# EasyEDA Pro project OctoSlime_Switch_Unit.eprj

# Schematic Schematic1
Create Date: 2022-07-29; Page Name: P1; Project Name: OctoSlime_Switch_Unit; Schematic Name: Schematic1; Update Date: 2022-08-04; Company: EmbeddedAT; Drawed: KeonMan; Reviewed: KeonMan; Version: 1.0
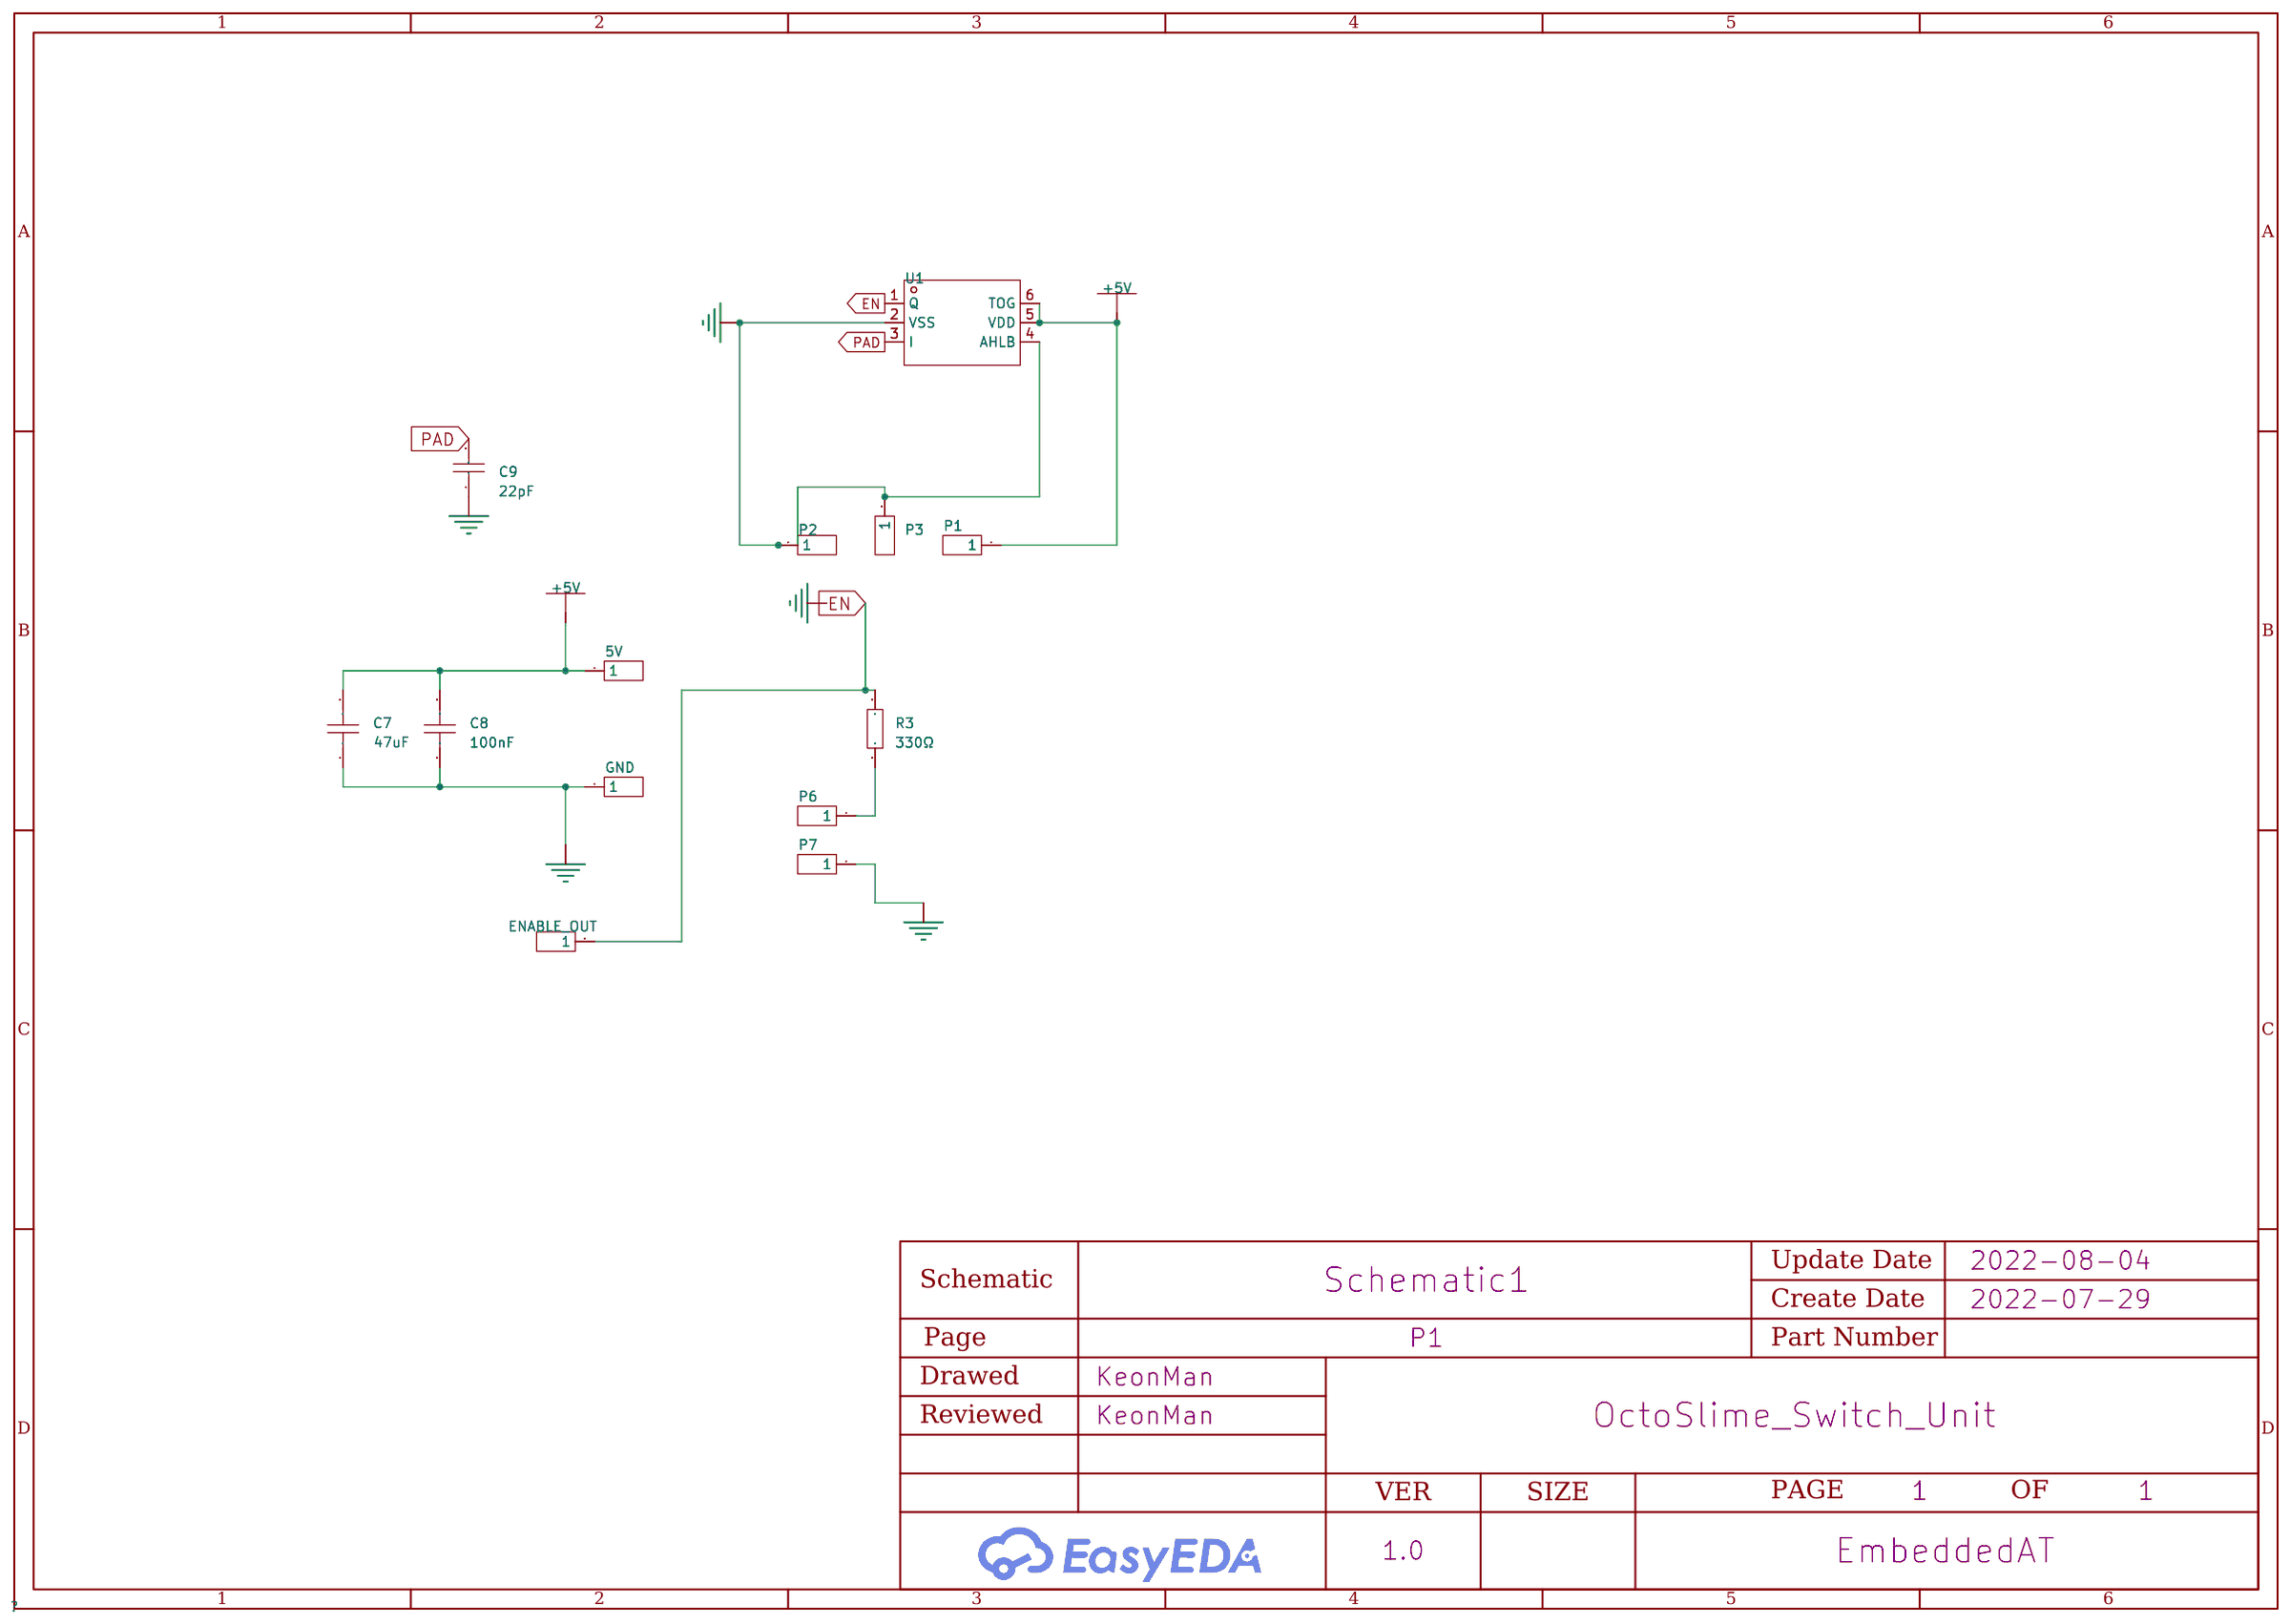
[diagram p0: schematic sheet]

## Parts
5V  -  [HDR-TH_1P-P2.54-V-M]  (no BOM)
C7  47uF  [C1206]
C8  100nF  [C0402]
C9  22pF  [C0805]
ENABLE_OUT  -  [HDR-TH_1P-P2.54-V-M]  (no BOM)
GND  -  [HDR-TH_1P-P2.54-V-M]  (no BOM)
P1  -  [HDR-TH_1P-P2.54-V-M]  (no BOM)
P2  -  [HDR-TH_1P-P2.54-V-M]  (no BOM)
P3  -  [HDR-TH_1P-P2.54-V-M]  (no BOM)
P6  -  [HDR-TH_1P-P2.54-V-M]  (no BOM)
P7  -  [HDR-TH_1P-P2.54-V-M]  (no BOM)
R3  330Ω  [R0805]
U1  -  [SOT-23-6_L2.9-W1.6-P0.95-LS2.8-BR]  (no BOM)

## Library data of the parts
5V ENABLE_OUT GND P1-P3 P6 P7 = 2.54-1*1P针: 间距:-;总PIN位数:1;排数:1;插针结构:-;行距:-;安装类型:直插;圆针/方针:-;额定电流:-;额定电压:-;配合针长度:-;塑高:-;触头材质:-;触头镀层:-;颜色:黑色;; LCSC Part Name: 1x1P; Supplier Part: C81276; Manufacturer: BOOMELE(博穆精密); Supplier Footprint: 插件; JLCPCB Part Class: Extended Part; Supplier: LCSC; Number of Pins: 1; Number of Rows: 1; Mounting Type: 直插; Color: 黑色; LCSC On Sale: 1; JLCPCB On Sale: 1; Type: 直插; Connector Type: 排针
C7 = CL31A476MPHNNNE: 容值:47uF;精度:±20%;额定电压:10V;温度系数:X5R;; LCSC Part Name: 47uF ±20% 10V; Supplier Part: C96123; Manufacturer: SAMSUNG(三星); Supplier Footprint: 1206; JLCPCB Part Class: Basic Part; Datasheet: https://atta.szlcsc.com/upload/public/pdf/source/20170228/1488267692219.pdf; Supplier: LCSC; Tolerance: ±20%; Voltage Rated: 10V; Temperature Coefficient: X5R
C8 = CL05B104KB54PNC: 容值:100nF;精度:±10%;额定电压:50V;温度系数:X7R;; LCSC Part Name: 100nF ±10% 50V; Supplier Part: C307331; Manufacturer: SAMSUNG(三星); Supplier Footprint: 0402; JLCPCB Part Class: Basic Part; Datasheet: https://atta.szlcsc.com/upload/public/pdf/source/20181009/C307331_222F7C870FD3EA5F46F538B483443886.pdf; Supplier: LCSC; Tolerance: ±10%; Voltage Rated: 50V; Temperature Coefficient: X7R
C9 = CL21C220JBANNNC: 容值:22pF;精度:±5%;额定电压:50V;温度系数:C0G;; LCSC Part Name: 22pF ±5% 50V; Supplier Part: C1804; Manufacturer: SAMSUNG(三星); Supplier Footprint: 0805; JLCPCB Part Class: Basic Part; Datasheet: https://atta.szlcsc.com/upload/public/pdf/source/20160103/1457707697973.pdf; Supplier: LCSC; Tolerance: ±5%; Voltage Rated: 50V; Temperature Coefficient: C0G
R3 = 0805W8F3300T5E: 电阻类型:厚膜电阻;阻值:330Ω;精度:±1%;功率:125mW;温度系数:±100ppm/;最大工作电压:150V;工作温度范围:-55~+155;; LCSC Part Name: 330Ω ±1%; Supplier Part: C17630; Manufacturer: UNI-ROYAL(厚声); Supplier Footprint: 0805; JLCPCB Part Class: Basic Part; Datasheet: https://atta.szlcsc.com/upload/public/pdf/source/20200306/C422600_1E6D84923E4A46A82E41ADD87F860B5C.pdf; Supplier: LCSC; Type: 厚膜电阻; Tolerance: ±1%; Power(Watts): 125mW; Temperature Coefficient: ±100ppm/; Overload Voltage (Max): 150V; Operating Temperature Range: -55~+155
U1 = TTP223E-BA6: 单按键触摸感应开关; LCSC Part Name: TTP223E-BA6 停产; Supplier Part: C129457; Manufacturer: TONTEK(台湾通泰); Supplier Footprint: SOT-23-6; JLCPCB Part Class: Extended Part; Datasheet: https://atta.szlcsc.com/upload/public/pdf/source/20170914/C129457_1505360037116968239.pdf; Supplier: LCSC

## Nets
+5V: 5V.1 C7.2 C8.2 P1.1 U1.5(VDD) U1.6(TOG)
GND: C7.1 C8.1 C9.1 GND.1 P2.1 P3.1 P7.1 U1.2(VSS) U1.4(AHLB)
EN: ENABLE_OUT.1 R3.2 U1.1(Q)
PAD: C9.2 U1.3(I)
$1N2744: P6.1 R3.1

# Board PCB1
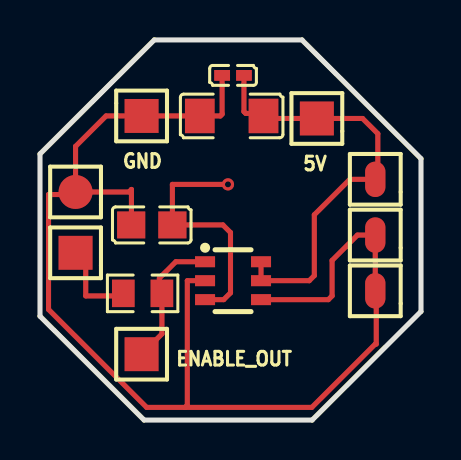
[diagram p1: board, top side]
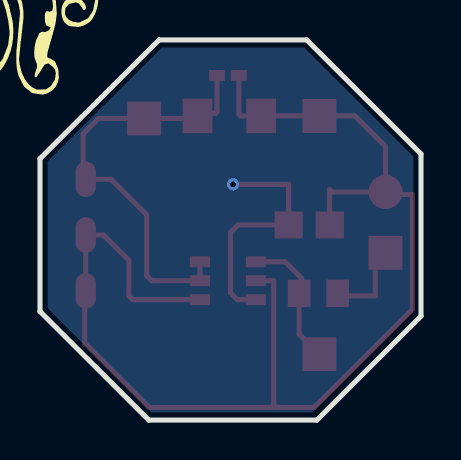
[diagram p2: board, bottom side, seen from below]

Outline 19.05 x 19.05 mm; copper layers: Top Layer, Inner1, Inner2, Bottom Layer. Coordinates in mm from the lower left corner of the outline.
Outline path: 0,13.33 5.72,19.05 13.1,19.05 19.05,13.1 19.05,5.44 13.61,0 5.21,0 0,5.21 0,13.33
Stack: Top Layer 0.035mm / Dielectric1 0.48mm PP er 4.5 / Inner1 0.035mm / Dielectric2 0.48mm FR4 er 4.5 / Inner2 0.035mm / Dielectric3 0.48mm PP er 4.5 / Bottom Layer 0.035mm

## Design rules (mm)
spacing safeClearance (default): track to track 0.152, other pairs 0.152 to 0.3
track width trackWidth (default): min 0.127, default 0.254, max 2.54
differential pair differentialPair (default): width min 0.127, default 0.254, max 2.54; gap min 0.152, default 0.152
via viaSize (default): diameter min 0.5, default 0.61, max 10; hole min 0.3, default 0.305, max 6

## Placement (name value [footprint] x y rotation side)
5V  -  [HDR-TH_1P-P2.54-V-M#2]  13.84 15.11 0 top
C7  47uF  [C1206]  9.58 15.24 0 top
C8  100nF  [C0402]  9.65 17.27 0 top
C9  22pF  [C0805]  5.59 9.78 0 top
ENABLE_OUT  -  [HDR-TH_1P-P2.54-V-M#2]  5.08 3.3 0 top
GND  -  [HDR-TH_1P-P2.54-V-M#2]  5.08 15.24 180 top
P1  -  [HDR-TH_1P-P2.54-V-M]  16.76 12.06 0 top
P2  -  [HDR-TH_1P-P2.54-V-M]  16.76 6.48 0 top
P3  -  [HDR-TH_1P-P2.54-V-M]  16.76 9.27 0 top
P6  -  [HDR-TH_1P-P2.54-V-M#2]  1.78 8.38 0 top
P7  -  [HDR-TH_1P-P2.54-V-M#3]  1.78 11.43 0 top
R3  330Ω  [R0805]  5.13 6.35 0 top
U1  -  [SOT-23-6_L2.9-W1.6-P0.95-LS2.8-BR]  9.65 6.98 180 top

## Footprints (pads in the part's own frame, mm; a bottom-side part is the same pattern mirrored in y, then rotated)
C0402
  rect 0.79x0.541 smd: 1(-0.546,0) 2(0.546,0)
C0805
  rect 1.409x1.351 smd: 1(-1.028,0) 2(1.031,0)
C1206
  rect 1.486x1.727 smd: 1(-1.593,0) 2(1.593,0)
HDR-TH_1P-P2.54-V-M
  oval 1.016x1.778 smd: 1(0,0)
HDR-TH_1P-P2.54-V-M#2
  rect 1.7x1.7 smd: 1(0,0)
HDR-TH_1P-P2.54-V-M#3
  round 1.7 smd: 1(0,0)
R0805
  rect 1.133x1.377 smd: 1(-0.965,0) 2(0.965,0)
SOT-23-6_L2.9-W1.6-P0.95-LS2.8-BR
  rect 1.001x0.551 smd: 1(1.399,-0.95) 2(1.399,0) 3(1.399,0.95) 4(-1.399,0.95) 5(-1.399,0) 6(-1.399,-0.95)

## Nets
As in the schematic.

## Via types
v1: diameter 0.61, hole 0.305, Top Layer to Bottom Layer, 1 via

## Routing (per net, layer and track width the routed paths; a pad name or vN(x,y) marks a point on that pad's centre or on a via; arc(x,y) is an arc through that point)
+5V: length 21.9
  Top Layer w0.254: U1.6 U1.5 13.46,6.98 13.72,7.24 13.72,10.29 15.49,12.06 P1.1 16.89,12.19 16.89,14.35 16.13,15.11 5V.1 11.3,15.11 11.05,15.37 10.29,15.37 10.2,15.46 C8.2
GND: length 64.6
  Top Layer w0.254: C9.1 4.57,9.79 4.57,11.56 4.44,11.43 P7.1 ; U1.4 14.42,6.03 14.6,6.22 14.6,8 15.88,9.27 P3.1 P2.1 16.81,6.43 16.81,3.81 16.76,3.81 13.59,0.63 7.25,0.63 ; P7.1 1.65,11.3 0.43,11.3 0.43,5.54 5.33,0.63 7.25,0.63 ; P7.1 1.78,13.72 3.3,15.24 GND.1 C7.1 9.02,15.24 9.11,15.33 C8.1 ; U1.2 7.37,6.98 7.37,0.75 7.25,0.63
EN: length 7.1
  Top Layer w0.254: U1.1 6.79,7.94 5.97,7.11 5.97,6.3 6.1,6.17 ; 6.1,6.17 6.1,4.32 ENABLE_OUT.1 ; 6.1,6.17 R3.2
PAD: length 12.3
  Top Layer w0.254: v1(9.4,11.81) 6.62,11.81 C9.2 9.14,9.78 9.53,9.4 9.53,6.38 9.18,6.03 U1.3
$1N2744: length 4.3
  Top Layer w0.254: P6.1 2.29,7.87 2.29,6.22 4.04,6.22 R3.1

## Copper pours and planes (outline as drawn; the poured copper is in the pictures)
PAD on Bottom Layer: 0.38,18.67 18.67,18.67 18.67,0.38 0.38,0.38

Small or netless copper shapes (teardrops, artwork), in the pictures only: 1 on Bottom Layer
